# Altium schematic sheet FPGA.SchDoc
size A2 portrait; SheetNumber: 1; SheetTotal: 15
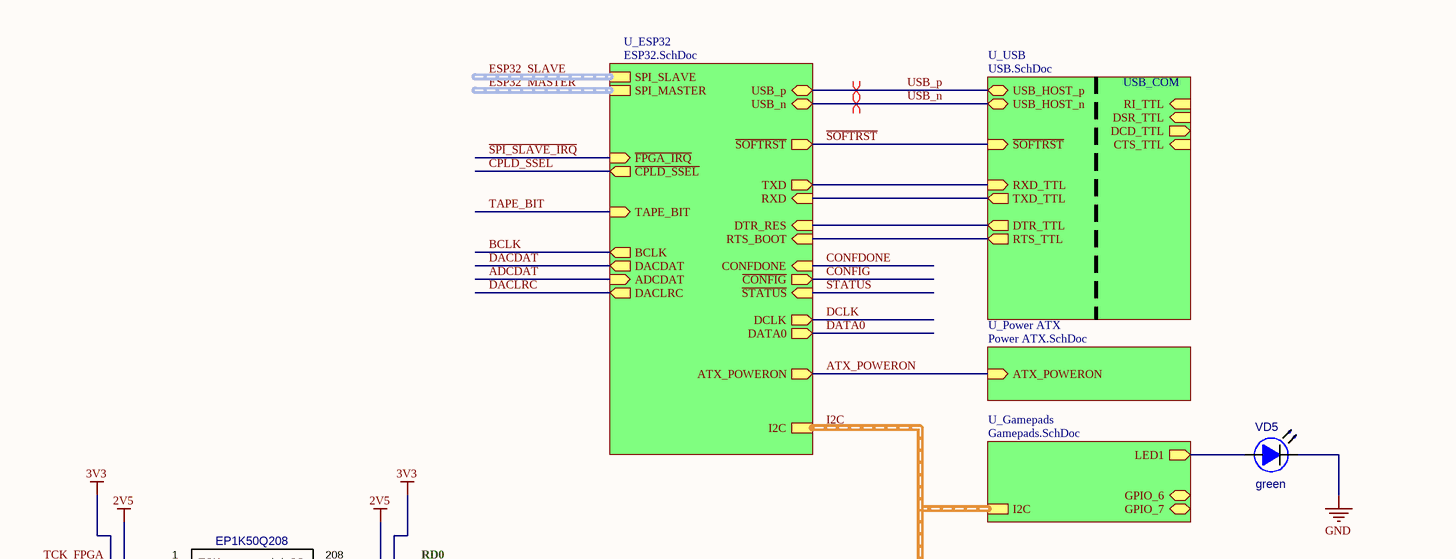
[diagram p0: FPGA.SchDoc, top]
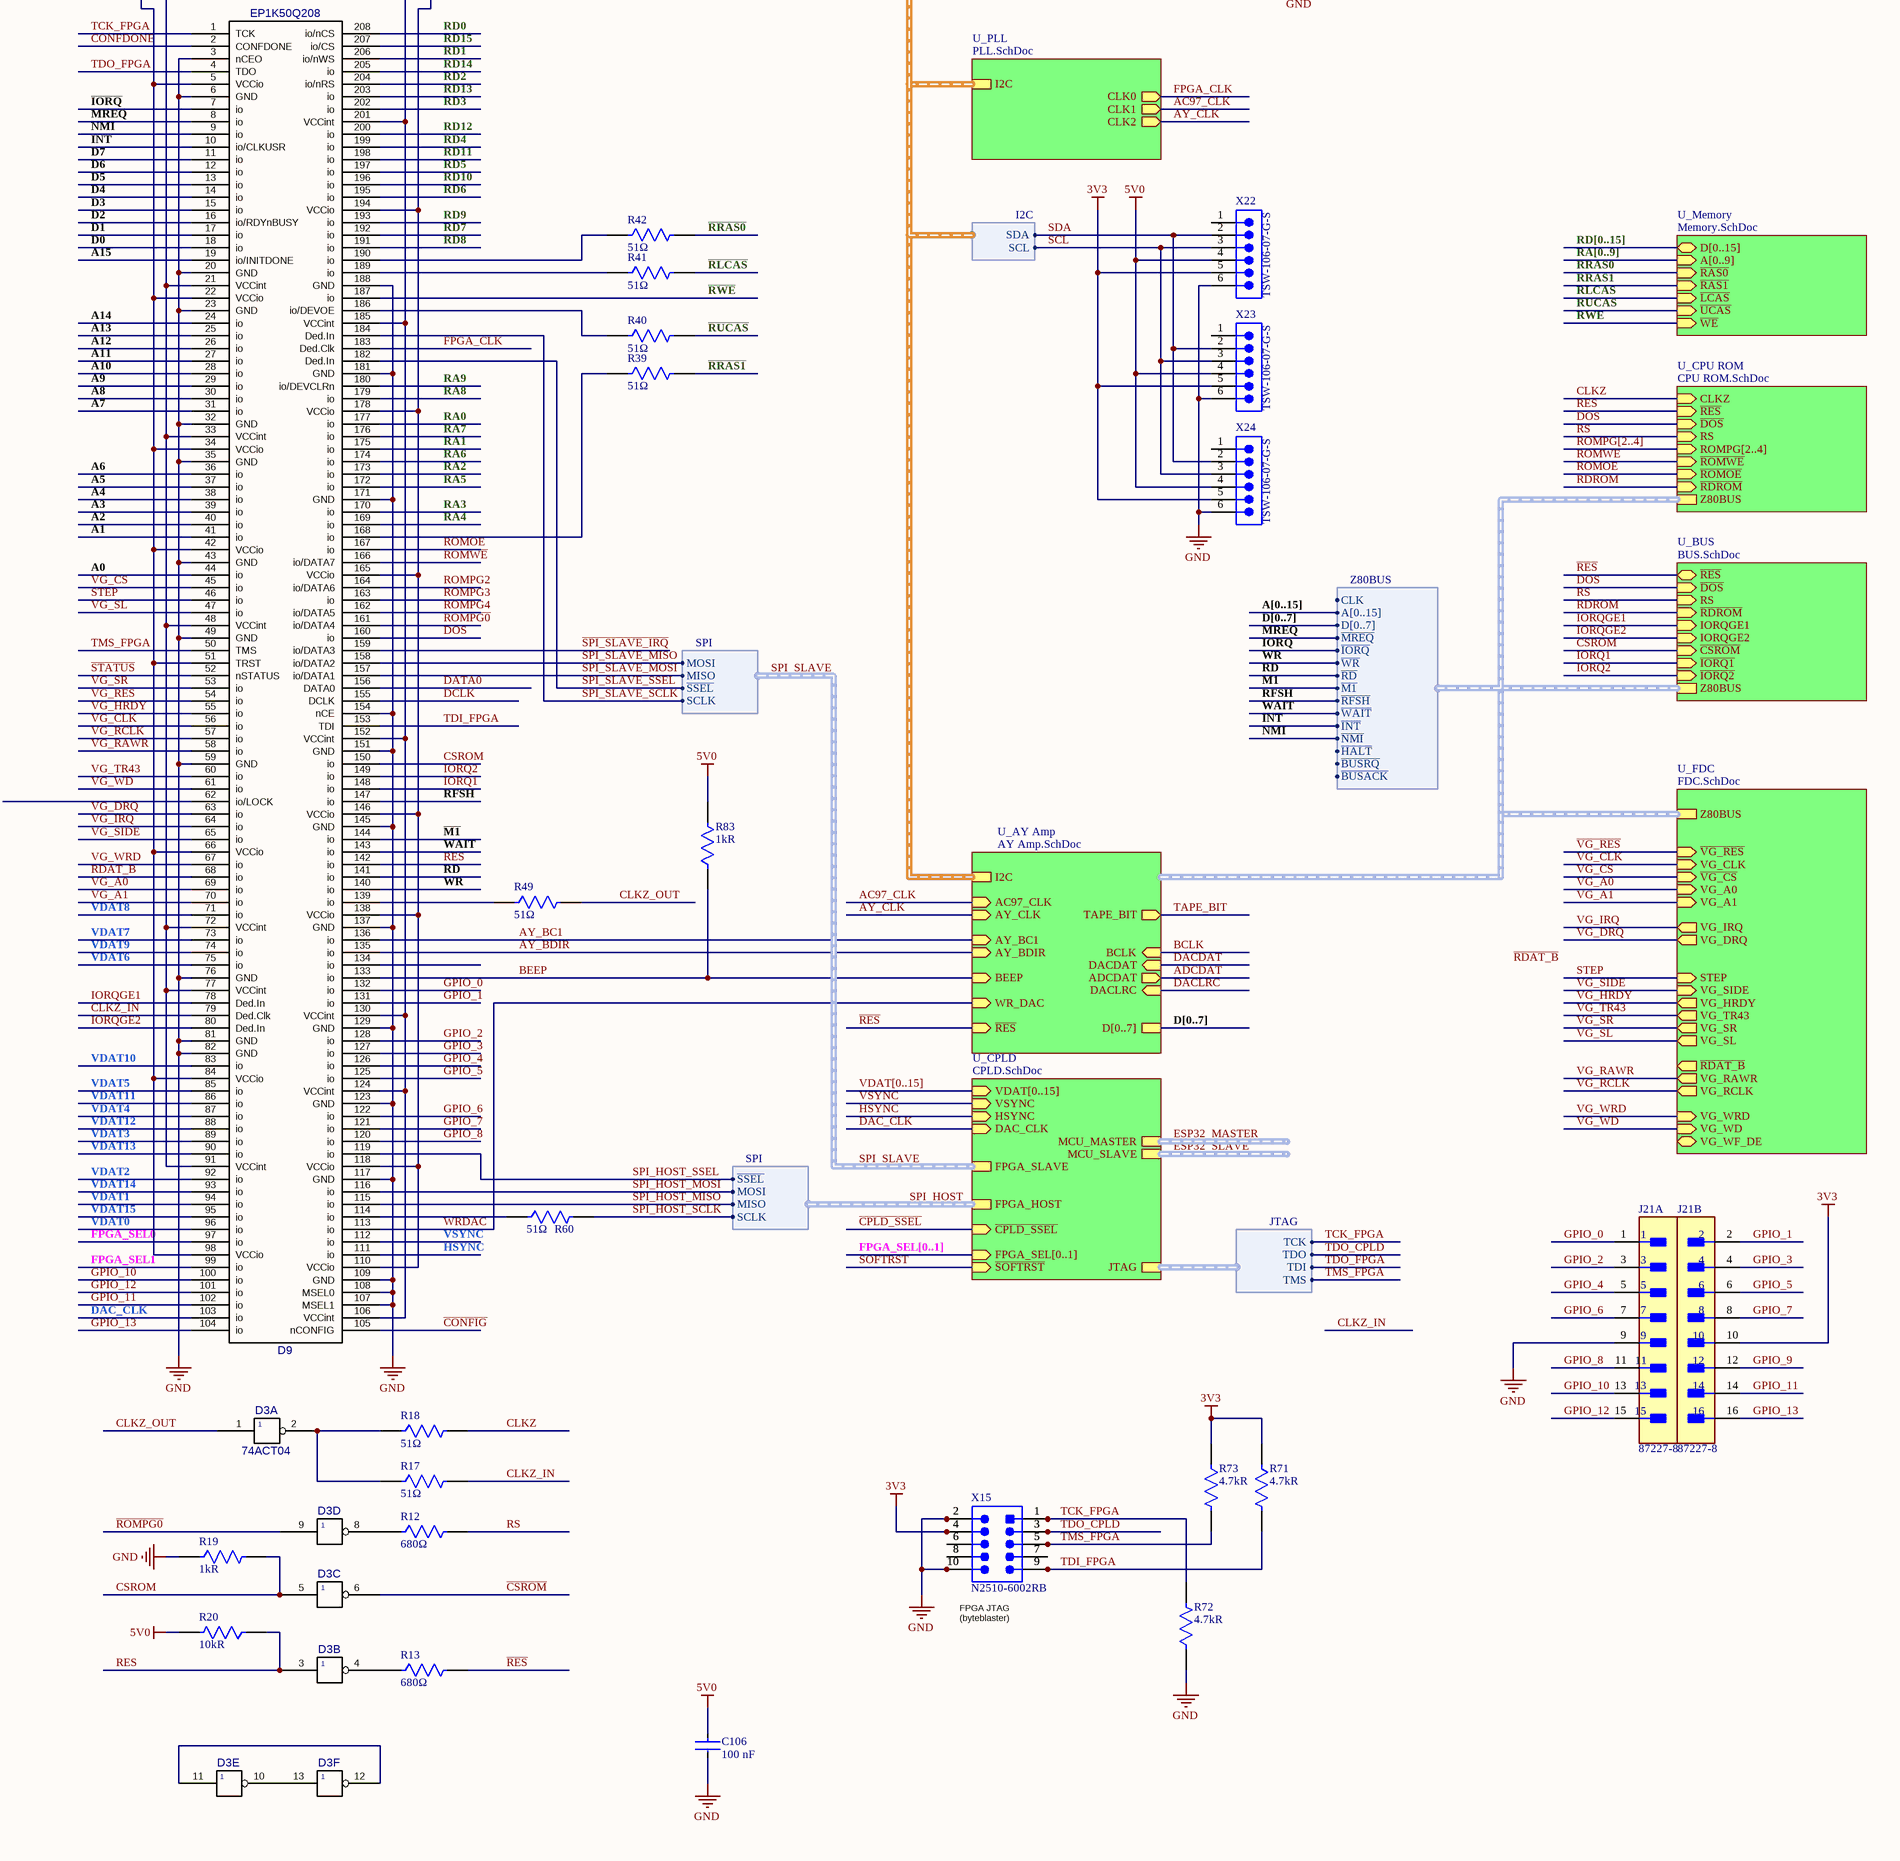
[diagram p1: FPGA.SchDoc, bottom]

## Parts
C106  Capacitance: 100 nF  [FP-CC0805-0_85-IPC_A]  (hidden comment: CC0805KRX7R9BB104)
D3  value 74ACT04  [SO14]  (hidden comment: 04)  (parts A,B,C,D,E,F of 6)
D9  EP1K50Q208  [PQFP208X5]
J21  87227-8  [FP-87227-8-MFG]  (parts A,B of 2)
R12  value 680Ω  [FP-RT0805-IPC_A]  (hidden comment: RT0805FRE07680RL)
R13  value 680Ω  [FP-RT0805-IPC_A]  (hidden comment: RT0805FRE07680RL)
R17  Resistance: 51Ω  [FP-RR1220-IPC_A]  (hidden comment: RR1220Q-510-D)
R18  Resistance: 51Ω  [FP-RR1220-IPC_A]  (hidden comment: RR1220Q-510-D)
R19  Resistance: 1kR  [FP-CRCW0805-HPe3-IPC_A]  (hidden comment: CRCW08051K00FKEAHP)
R20  Resistance: 10kR  [FP-CR0805-IPC_A]  (hidden comment: CR0805-JW-103ELF)
R39  Resistance: 51Ω  [FP-RR1220-IPC_A]  (hidden comment: RR1220Q-510-D)
R40  Resistance: 51Ω  [FP-RR1220-IPC_A]  (hidden comment: RR1220Q-510-D)
R41  Resistance: 51Ω  [FP-RR1220-IPC_A]  (hidden comment: RR1220Q-510-D)
R42  Resistance: 51Ω  [FP-RR1220-IPC_A]  (hidden comment: RR1220Q-510-D)
R49  Resistance: 51Ω  [FP-RR1220-IPC_A]  (hidden comment: RR1220Q-510-D)
R60  Resistance: 51Ω  [FP-RR1220-IPC_A]  (hidden comment: RR1220Q-510-D)
R71  Resistance: 4.7kR  [FP-CR0805-IPC_A]  (hidden comment: CR0805-JW-472ELF)
R72  Resistance: 4.7kR  [FP-CR0805-IPC_A]  (hidden comment: CR0805-JW-472ELF)
R73  Resistance: 4.7kR  [FP-CR0805-IPC_A]  (hidden comment: CR0805-JW-472ELF)
R83  Resistance: 1kR  [FP-CRCW0805-HPe3-IPC_A]  (hidden comment: CRCW08051K00FKEAHP)
VD5  value green  [LED100_LED(Primary)]  (hidden comment: LED)
X15  N2510-6002RB  [3M-N2510-6002-10_V]
X22  TSW-106-07-G-S  [SMTC-TSW-106-07-X-S]
X23  TSW-106-07-G-S  [SMTC-TSW-106-07-X-S]
X24  TSW-106-07-G-S  [SMTC-TSW-106-07-X-S]

## Sub-sheets
U_AY Amp = AY Amp.SchDoc: AY_BC1 (in), ~{RES} (in), AY_CLK (in), AY_BDIR (in), I2C (harness I2C), DACDAT (in), TAPE_BIT (out), ADCDAT (out), BCLK (in), BEEP (in), DACLRC (in), WR_DAC (in), D[0..7], AC97_CLK (in)
U_BUS = BUS.SchDoc: ~{RES} (bidir), ~{DOS} (in), RS (in), ~{RDROM} (in), IORQGE1 (in), IORQGE2 (in), ~{CSROM} (in), ~{IORQ1} (in), ~{IORQ2} (in), Z80BUS (harness Z80BUS)
U_CPLD = CPLD.SchDoc: VDAT[0..15] (in), VSYNC (in), HSYNC (in), DAC_CLK (in), FPGA_HOST (harness SPI), FPGA_SLAVE (harness SPI), MCU_MASTER (harness SPI), MCU_SLAVE (harness SPI), FPGA_SEL[0..1] (in), JTAG (harness JTAG), ~{SOFTRST} (in), ~{CPLD_SSEL} (in)
U_CPU ROM = CPU ROM.SchDoc: CLKZ (in), ~{RES} (in), ~{DOS} (in), RS (in), ROMPG[2..4] (in), ~{ROMWE} (in), ~{ROMOE} (in), ~{RDROM} (in), Z80BUS (harness Z80BUS)
U_ESP32 = ESP32.SchDoc: SPI_SLAVE (harness SPI), TXD (out), RXD (in), DTR_RES (in), RTS_BOOT (in), I2C (harness I2C), TAPE_BIT (in), USB_n (bidir), USB_p (bidir), SPI_MASTER (harness SPI), ~{SOFTRST} (out), ATX_POWERON (out), ~{FPGA_IRQ} (in), DCLK (out), DATA0 (out), ~{STATUS} (in), CONFDONE (in), ~{CONFIG} (out), ~{CPLD_SSEL} (out), DACLRC (out), ADCDAT (in), BCLK (out), DACDAT (out)
U_FDC = FDC.SchDoc: VG_CLK (in), VG_IRQ (out), VG_DRQ (out), ~{VG_CS} (in), VG_SIDE (in), STEP (in), VG_A0 (in), VG_A1 (in), VG_TR43 (out), VG_SR (out), VG_SL (out), VG_WD (in), VG_WRD (in), VG_WF_DE (bidir), VG_RAWR (out), VG_RCLK (out), ~{VG_RES} (in), VG_HRDY (out), Z80BUS (harness Z80BUS), ~{RDAT_B} (out)
U_Gamepads = Gamepads.SchDoc: GPIO_7 (bidir), LED1 (out), GPIO_6 (bidir), I2C (harness I2C)
U_Memory = Memory.SchDoc: D[0..15] (bidir), A[0..9] (in), ~{RAS0} (in), ~{RAS1} (in), ~{LCAS} (in), ~{UCAS} (in), ~{WE} (in)
U_PLL = PLL.SchDoc: CLK0 (out), CLK1 (out), CLK2 (out), I2C (harness I2C)
U_Power ATX = Power ATX.SchDoc: ATX_POWERON (in)
U_USB = USB.SchDoc: RXD_TTL (in), USB_HOST_p (bidir), TXD_TTL (out), RTS_TTL (out), CTS_TTL (in), DCD_TTL (out), DSR_TTL (in), USB_HOST_n (bidir), RI_TTL (in), DTR_TTL (out), ~{SOFTRST} (in)

## Harnesses
SPI: ~{SSEL}, SCLK, MOSI, MISO
JTAG: TCK, TDO, TDI, TMS
I2C: SDA, SCL
Z80BUS: A[0..15], D[0..7], ~{MREQ}, ~{IORQ}, ~{WR}, ~{RD}, ~{M1}, ~{RFSH}, ~{WAIT}, ~{INT}, ~{NMI}, ~{HALT}, ~{BUSRQ}, ~{BUSACK}, CLK

## Nets
2V5: D9.21(VCCint) D9.33(VCCint) D9.48(VCCint) D9.72(VCCint) D9.77(VCCint) D9.91(VCCint) D9.106(VCCint) D9.124(VCCint) D9.130(VCCint) D9.152(VCCint) D9.185(VCCint) D9.201(VCCint)
3V3: D9.5(VCCio) D9.22(VCCio) D9.34(VCCio) D9.42(VCCio) D9.51(TRST) D9.66(VCCio) D9.84(VCCio) D9.98(VCCio) D9.110(VCCio) D9.118(VCCio) D9.138(VCCio) D9.146(VCCio) D9.165(VCCio) D9.178(VCCio) D9.194(VCCio) J21.10 R71.1 R73.1 X15.4 X22.5 X23.5 X24.5
5V0: C106.1 R20.2 R83.2 X22.4 X23.4 X24.4
GND: C106.2 D3.7(GND) D9.3(nCEO) D9.6(GND) D9.20(GND) D9.23(GND) D9.32(GND) D9.35(GND) D9.43(GND) D9.49(GND) D9.59(GND) D9.76(GND) D9.81(GND) D9.82(GND) D9.107(MSEL1) D9.108(MSEL0) D9.109(GND) D9.117(GND) D9.123(GND) D9.129(GND) D9.137(GND) D9.145(GND) D9.151(GND) D9.154(nCE) D9.171(GND) D9.181(GND) D9.188(GND) J21.9 R19.1 R72.1 VD5.K X15.2 X15.10 X22.6 X23.6 X24.6
VCC5: D3.14(+5v)
A0: D9.44(io)
A1: D9.41(io)
A2: D9.40(io)
A3: D9.39(io)
A4: D9.38(io)
A5: D9.37(io)
A6: D9.36(io)
A7: D9.31(io)
A8: D9.30(io)
A9: D9.29(io)
A10: D9.28(io)
A11: D9.27(io)
A12: D9.26(io)
A13: D9.25(io)
A14: D9.24(io)
A15: D9.19(io/INITDONE)
AC97_CLK: sheet U_AY Amp/AC97_CLK, sheet U_PLL/CLK1
ADCDAT: sheet U_ESP32/ADCDAT, sheet U_AY Amp/ADCDAT
ATX_POWERON: sheet U_Power ATX/ATX_POWERON, sheet U_ESP32/ATX_POWERON
AY_BC1: D9.136(io) ; sheet U_AY Amp/AY_BC1
AY_BDIR: D9.135(io) ; sheet U_AY Amp/AY_BDIR
AY_CLK: sheet U_AY Amp/AY_CLK, sheet U_PLL/CLK2
BCLK: sheet U_ESP32/BCLK, sheet U_AY Amp/BCLK
BEEP: D9.133(io) R83.1 ; sheet U_AY Amp/BEEP
~{CONFIG}: D9.105(nCONFIG) ; sheet U_ESP32/~{CONFIG}
~{CPLD_SSEL}: sheet U_CPLD/~{CPLD_SSEL}, sheet U_ESP32/~{CPLD_SSEL}
~{CSROM}: D3.6 ; sheet U_BUS/~{CSROM}
CLKZ: R18.2 ; sheet U_CPU ROM/CLKZ
CLKZ_IN: D9.79(Ded.Clk) R17.2
CLKZ_OUT: D3.1 R49.2
CONFDONE: D9.2(CONFDONE) ; sheet U_ESP32/CONFDONE
CSROM: D3.5 D9.150(io) R19.2
D0: D9.18(io)
D1: D9.17(io)
D2: D9.16(io/RDYnBUSY)
D3: D9.15(io)
D4: D9.14(io)
D5: D9.13(io)
D6: D9.12(io)
D7: D9.11(io)
~{DOS}: D9.160(io) ; sheet U_CPU ROM/~{DOS}, sheet U_BUS/~{DOS}
DAC_CLK: D9.103(io) ; sheet U_CPLD/DAC_CLK
DACDAT: sheet U_ESP32/DACDAT, sheet U_AY Amp/DACDAT
DACLRC: sheet U_ESP32/DACLRC, sheet U_AY Amp/DACLRC
DATA0: D9.156(DATA0) ; sheet U_ESP32/DATA0
DCLK: D9.155(DCLK) ; sheet U_ESP32/DCLK
FPGA_CLK: D9.183(Ded.Clk) ; sheet U_PLL/CLK0
FPGA_SEL0: D9.97(io)
FPGA_SEL1: D9.99(io)
GPIO_0: D9.132(io) J21.1
GPIO_1: D9.131(io) J21.2
GPIO_2: D9.128(io) J21.3
GPIO_3: D9.127(io) J21.4
GPIO_4: D9.126(io) J21.5
GPIO_5: D9.125(io) J21.6
GPIO_6: D9.122(io) J21.7
GPIO_7: D9.121(io) J21.8
GPIO_8: D9.120(io) J21.11
GPIO_9: J21.12
GPIO_10: D9.100(io) J21.13
GPIO_11: D9.102(io) J21.14
GPIO_12: D9.101(io) J21.15
GPIO_13: D9.104(io) J21.16
HSYNC: D9.111(io) ; sheet U_CPLD/HSYNC
~{INT}: D9.10(io/CLKUSR) ; sheet U_CPU ROM/Z80BUS.~{INT}
~{IORQ}: D9.7(io) ; sheet U_CPU ROM/Z80BUS.~{IORQ}
~{IORQ1}: D9.148(io) ; sheet U_BUS/~{IORQ1}
~{IORQ2}: D9.149(io) ; sheet U_BUS/~{IORQ2}
IORQGE1: D9.78(Ded.In) ; sheet U_BUS/IORQGE1
IORQGE2: D9.80(Ded.In) ; sheet U_BUS/IORQGE2
~{M1}: D9.144(io) ; sheet U_CPU ROM/Z80BUS.~{M1}
~{MREQ}: D9.8(io) ; sheet U_CPU ROM/Z80BUS.~{MREQ}
~{NMI}: D9.9(io) ; sheet U_CPU ROM/Z80BUS.~{NMI}
~{RD}: D9.141(io) ; sheet U_CPU ROM/Z80BUS.~{RD}
~{RDAT_B}: D9.68(io)
~{RDROM}: sheet U_CPU ROM/~{RDROM}, sheet U_BUS/~{RDROM}
~{RES}: R13.2 ; sheet U_CPU ROM/~{RES}, sheet U_BUS/~{RES}, sheet U_AY Amp/~{RES}
~{RFSH}: D9.147(io) ; sheet U_CPU ROM/Z80BUS.~{RFSH}
~{RLCAS}: R41.2 ; sheet U_Memory/~{LCAS}
~{ROMOE}: D9.167(io) ; sheet U_CPU ROM/~{ROMOE}
~{ROMPG0}: D3.9 D9.161(io/DATA4)
~{ROMWE}: D9.166(io/DATA7) ; sheet U_CPU ROM/~{ROMWE}
~{RRAS0}: R42.2 ; sheet U_Memory/~{RAS0}
~{RRAS1}: R39.2 ; sheet U_Memory/~{RAS1}
~{RUCAS}: R40.2 ; sheet U_Memory/~{UCAS}
~{RWE}: D9.187(io) ; sheet U_Memory/~{WE}
RA0: D9.177(io)
RA1: D9.175(io)
RA2: D9.173(io)
RA3: D9.170(io)
RA4: D9.169(io)
RA5: D9.172(io)
RA6: D9.174(io)
RA7: D9.176(io)
RA8: D9.179(io)
RA9: D9.180(io/DEVCLRn)
RD0: D9.208(io/nCS)
RD1: D9.206(io/nWS)
RD2: D9.204(io/nRS)
RD3: D9.202(io)
RD4: D9.199(io)
RD5: D9.197(io)
RD6: D9.195(io)
RD7: D9.192(io)
RD8: D9.191(io)
RD9: D9.193(io)
RD10: D9.196(io)
RD11: D9.198(io)
RD12: D9.200(io)
RD13: D9.203(io)
RD14: D9.205(io)
RD15: D9.207(io/CS)
RES: D3.3 D9.142(io) R20.1
ROMPG2: D9.164(io/DATA6)
ROMPG3: D9.163(io)
ROMPG4: D9.162(io/DATA5)
RS: R12.2 ; sheet U_CPU ROM/RS, sheet U_BUS/RS
~{SOFTRST}: sheet U_CPLD/~{SOFTRST}, sheet U_USB/~{SOFTRST}, sheet U_ESP32/~{SOFTRST}
~{SPI_SLAVE_IRQ}: D9.159(io/DATA3) ; sheet U_ESP32/~{FPGA_IRQ}
~{SPI_SLAVE_SSEL}: D9.182(Ded.In) ; sheet U_CPLD/FPGA_SLAVE.~{SSEL}
~{STATUS}: D9.52(nSTATUS) ; sheet U_ESP32/~{STATUS}
SCL: X22.3 X23.3 X24.3 ; sheet U_ESP32/I2C.SCL  [project net I2C.SCL]
SDA: X22.2 X23.2 X24.2 ; sheet U_ESP32/I2C.SDA  [project net I2C.SDA]
SPI_HOST_MISO: D9.115(io) ; sheet U_CPLD/FPGA_HOST.MISO  [project net SPI_HOST.MISO]
SPI_HOST_MOSI: D9.116(io) ; sheet U_CPLD/FPGA_HOST.MOSI  [project net SPI_HOST.MOSI]
SPI_HOST_SCLK: R60.2 ; sheet U_CPLD/FPGA_HOST.SCLK  [project net SPI_HOST.SCLK]
SPI_HOST_SSEL: D9.119(io) ; sheet U_CPLD/FPGA_HOST.~{SSEL}  [project net SPI_HOST.~{SSEL}]
SPI_SLAVE_MISO: D9.158(io/DATA2) ; sheet U_CPLD/FPGA_SLAVE.MOSI  [project net SPI_SLAVE.MOSI]
SPI_SLAVE_MOSI: D9.157(io/DATA1) ; sheet U_CPLD/FPGA_SLAVE.MISO  [project net SPI_SLAVE.MISO]
SPI_SLAVE_SCLK: D9.184(Ded.In) ; sheet U_CPLD/FPGA_SLAVE.SCLK  [project net SPI_SLAVE.SCLK]
STEP: D9.46(io) ; sheet U_FDC/STEP
TAPE_BIT: sheet U_ESP32/TAPE_BIT, sheet U_AY Amp/TAPE_BIT
TCK_FPGA: D9.1(TCK) R72.2 X15.1 ; sheet U_CPLD/JTAG.TCK
TDI_FPGA: D9.153(TDI) R71.2 X15.9
TDO_CPLD: X15.3 ; sheet U_CPLD/JTAG.TDO
TDO_FPGA: D9.4(TDO) ; sheet U_CPLD/JTAG.TDI
TMS_FPGA: D9.50(TMS) R73.2 X15.5 ; sheet U_CPLD/JTAG.TMS
USB_n: sheet U_USB/USB_HOST_n, sheet U_ESP32/USB_n
USB_p: sheet U_USB/USB_HOST_p, sheet U_ESP32/USB_p
~{VG_CS}: D9.45(io) ; sheet U_FDC/~{VG_CS}
~{VG_RES}: D9.54(io) ; sheet U_FDC/~{VG_RES}
VDAT0: D9.96(io)
VDAT1: D9.94(io)
VDAT2: D9.92(io)
VDAT3: D9.89(io)
VDAT4: D9.87(io)
VDAT5: D9.85(io)
VDAT6: D9.75(io)
VDAT7: D9.73(io)
VDAT8: D9.71(io)
VDAT9: D9.74(io)
VDAT10: D9.83(io)
VDAT11: D9.86(io)
VDAT12: D9.88(io)
VDAT13: D9.90(io)
VDAT14: D9.93(io)
VDAT15: D9.95(io)
VG_A0: D9.69(io) ; sheet U_FDC/VG_A0
VG_A1: D9.70(io) ; sheet U_FDC/VG_A1
VG_CLK: D9.56(io) ; sheet U_FDC/VG_CLK
VG_DRQ: D9.63(io) ; sheet U_FDC/VG_DRQ
VG_HRDY: D9.55(io) ; sheet U_FDC/VG_HRDY
VG_IRQ: D9.64(io) ; sheet U_FDC/VG_IRQ
VG_RAWR: D9.58(io) ; sheet U_FDC/VG_RAWR
VG_RCLK: D9.57(io) ; sheet U_FDC/VG_RCLK
VG_SIDE: D9.65(io) ; sheet U_FDC/VG_SIDE
VG_SL: D9.47(io) ; sheet U_FDC/VG_SL
VG_SR: D9.53(io) ; sheet U_FDC/VG_SR
VG_TR43: D9.60(io) ; sheet U_FDC/VG_TR43
VG_WD: D9.61(io) ; sheet U_FDC/VG_WD
VG_WRD: D9.67(io) ; sheet U_FDC/VG_WRD
VSYNC: D9.112(io) ; sheet U_CPLD/VSYNC
~{WAIT}: D9.143(io) ; sheet U_CPU ROM/Z80BUS.~{WAIT}
~{WR}: D9.140(io) ; sheet U_CPU ROM/Z80BUS.~{WR}
WRDAC: D9.113(io) ; sheet U_AY Amp/WR_DAC
NetD3_2: D3.2 R17.1 R18.1
NetD3_4: D3.4 R13.1
NetD3_8: D3.8 R12.1
NetD3_10: D3.10 D3.13
NetD3_11: D3.11 D3.12
NetD9_114: D9.114(io) R60.1
NetD9_139: D9.139(io) R49.1
NetD9_168: D9.168(io) R39.1
NetD9_186: D9.186(io/DEVOE) R40.1
NetD9_189: D9.189(io) R41.1
NetD9_190: D9.190(io) R42.1
NetVD5_A: VD5.A ; sheet U_Gamepads/LED1
(unnamed): sheet U_USB/RXD_TTL, sheet U_ESP32/TXD
(unnamed): sheet U_USB/TXD_TTL, sheet U_ESP32/RXD
(unnamed): sheet U_USB/RTS_TTL, sheet U_ESP32/RTS_BOOT
(unnamed): sheet U_USB/DTR_TTL, sheet U_ESP32/DTR_RES

Not connected (* = marked no-connect by the designer): D9 62(io/LOCK) 134(io); X15 6 7 8; X22 1; X23 1; X24 1

## Buses and harness runs
bus A[0..15]
bus D[0..7]
bus D[0..7] = sheet U_AY Amp/D[0..7]
bus FPGA_SEL[0..1] = sheet U_CPLD/FPGA_SEL[0..1]
bus RA[0..9] = sheet U_Memory/A[0..9]
bus RD[0..15] = sheet U_Memory/D[0..15]
bus ROMPG[2..4] = sheet U_CPU ROM/ROMPG[2..4]
bus VDAT[0..15] = sheet U_CPLD/VDAT[0..15]
harness ESP32_MASTER = sheet U_CPLD/MCU_MASTER
harness ESP32_MASTER = sheet U_ESP32/SPI_MASTER
harness ESP32_SLAVE = sheet U_CPLD/MCU_SLAVE
harness ESP32_SLAVE = sheet U_ESP32/SPI_SLAVE
harness I2C = sheet U_AY Amp/I2C = sheet U_ESP32/I2C = sheet U_Gamepads/I2C = sheet U_PLL/I2C
harness sheet U_BUS/Z80BUS = sheet U_CPU ROM/Z80BUS = sheet U_FDC/Z80BUS
harness SPI_HOST = sheet U_CPLD/FPGA_HOST
harness SPI_SLAVE = sheet U_CPLD/FPGA_SLAVE

## Layout directives
differential pair: USB_n, USB_p

## Notes on the sheet
- USB_COM
- (near X15) FPGA JTAG
  (byteblaster)
- Labels drawn without touching a wire or pin: ~{RDAT_B}

## Library data of the parts
C106 = CMP-2100-03606-3: CAP CER 0.1UF 50V X7R 0805; Manufacturer: Yageo; Value: 100 nF; Manufacturer Part Number: CC0805KRX7R9BB104; Category: Cap; Case/Package: 0805
J21 = CMP-03369-000064-1: CONN HEADER VERT 16POS 2.54MM; Manufacturer: TE Connectivity; value: HEADER 16POS 2.54MM 2ROW; Pitch: 2.54mm; Manufacturer Part Number: 87227-8; Category: Connector; Case/Package: PLD-16
R12 R13 = CMP-03412-000082-1: RES SMD 680 OHM 1% 1/8W 0805; Manufacturer: Yageo; Category: Res; Manufacturer Part Number: RT0805FRE07680RL; Resistance: 680Ω; Case/Package: 0805
R17 R18 R39-R42 R49 R60 = CMP-2001-03561-2: 51Ω ±0.5% 0.1W 1/10W Chip Resistor 0805 (2012 Metric) Thin Film; Manufacturer: Susumu; Case/Package: 0805; Number of Terminations: 2; Termination: SMD/SMT; Number of Pins: 2; Manufacturer Part Number: RR1220Q-510-D; value: 51Ω; Category: Res
R19 R83 = CMP-02407-004529-1: RES Thick Film, 1kΩ, 1%, 0.5W, 100ppm/°C, 0805; Manufacturer: Vishay Dale; Case/Package: 0805; Number of Pins: 2; Termination: Solder; Manufacturer Part Number: CRCW08051K00FKEAHP; value: 1kΩ; Category: Res
R20 = CMP-07231-003873-1: Thick Film Chip Resistors 0805 10kΩ 0.125W 5% 200ppm/°C; Manufacturer: Bourns; value: 10kΩ; Manufacturer Part Number: CR0805-JW-103ELF; Number of Terminations: 2; Termination: SMD/SMT; Number of Pins: 2; Case/Package: 0805; Category: Res
R71-R73 = CMP-07231-004713-1: Thick Film Chip Resistors 0805 4.7kΩ 0.125W 5% 200ppm/°C; Manufacturer: Bourns; Case/Package: 0805; Number of Terminations: 2; Termination: SMD/SMT; Manufacturer Part Number: CR0805-JW-472ELF; value: 4.7kΩ; Category: Res
VD5 = LED: Light Emitting Diode; Category: Diode
X15 = CMP-2000-06794-1: Male Header, Pitch 2.54 mm, 2 x 5 Postion, Height 9.91 mm, Tail Length 2.84 mm, -55 to 105 degC, RoHS, Bulk; PartNumber: N2510; Manufacturer: 3M; Pitch: 2.54mm; value: 10-Pin Shrouded Header, 2.54mm; Manufacturer Part Number: N2510-6002RB; Case/Package: IDC-10; Category: Connector
X22-X24 = CMP-1024-00383-1: 0.025" SQ Post Header, Through-hole, Vertical, -55 to 125 degC, 2.54 mm Pitch, 6-Pin, Male, RoHS; Manufacturer: Samtec; Pitch: 2.54 mm; value: 6 pin header 2.54mm; PackageDescription: .025[0.64] SQ. Post Terminal Strip Assembly; PartNumber: TSW-106-07-G-S; Manufacturer Part Number: TSW-106-07-G-S; Case/Package: PLS-6; Category: Connector
D3 = 04: Case/Package: SOIC-14; Category: IC
D9 = EP1K50Q208: Value: EP1K50Q208; Case/Package: PQFP-208; Category: IC